# Altium schematic sheet RS485.SchDoc
size A; SheetNumber: 9; SheetTotal: 10
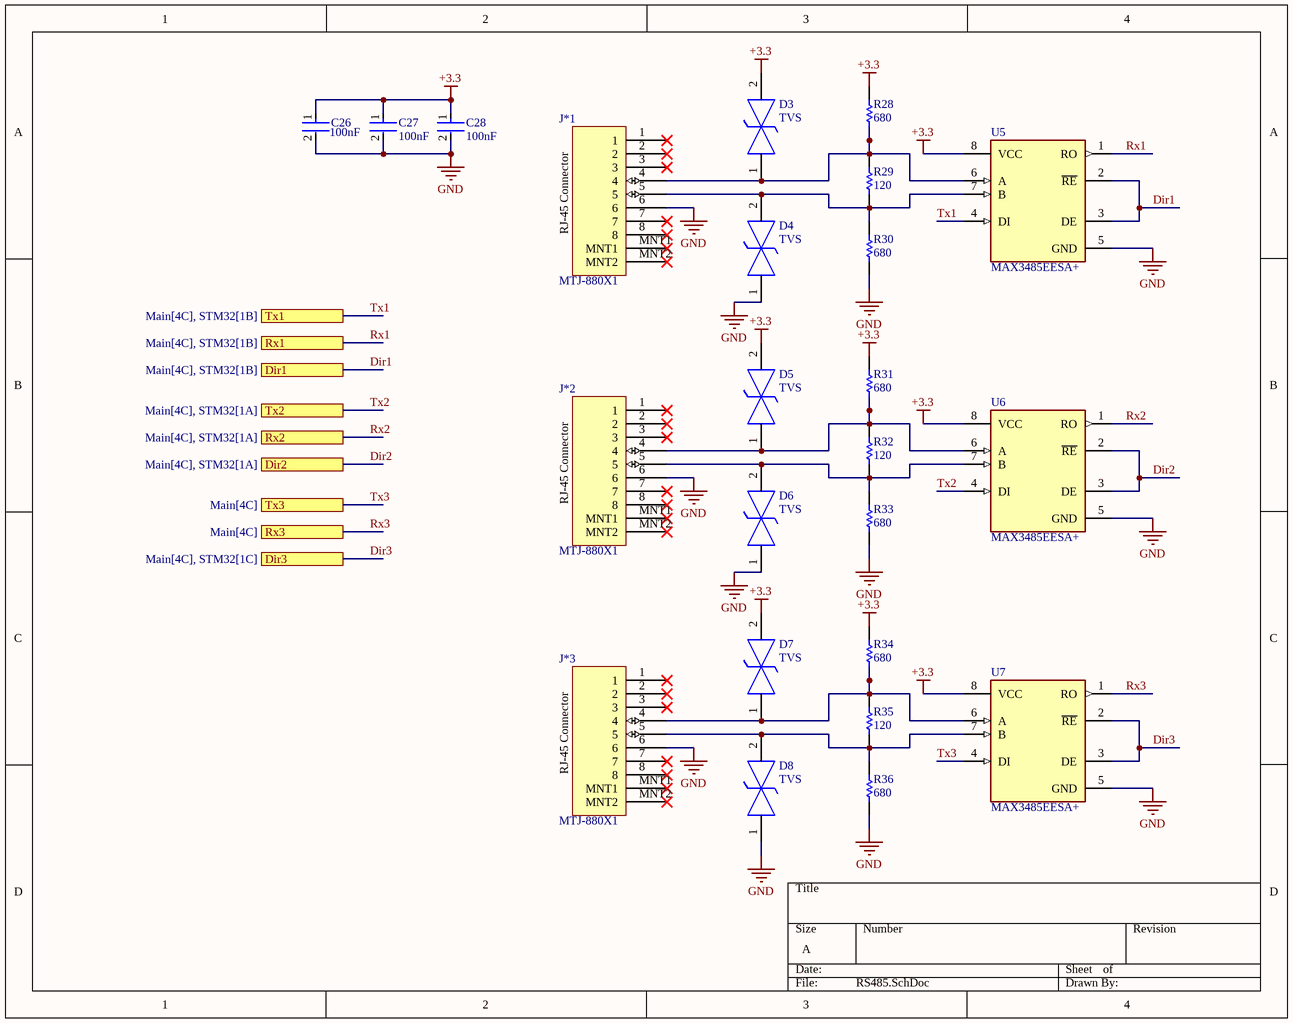
[diagram p0: RS485.SchDoc]

## Parts
C26  100nF  [FP-0805-L_2_01_0_2-W_1_25-IPC_B]
C27  100nF  [FP-0805-L_2_01_0_2-W_1_25-IPC_B]
C28  100nF  [FP-0805-L_2_01_0_2-W_1_25-IPC_B]
D3  TVS  [FP-SMB-MFG]
D4  TVS  [FP-SMB-MFG]
D5  TVS  [FP-SMB-MFG]
D6  TVS  [FP-SMB-MFG]
D7  TVS  [FP-SMB-MFG]
D8  TVS  [FP-SMB-MFG]
J*1  MTJ-880X1  [MTJ-880X1]
J*2  MTJ-880X1  [MTJ-880X1]
J*3  MTJ-880X1  [MTJ-880X1]
R28  680  [RESC2013X50X30LL20T20]
R29  120  [RESC2013X50X30LL20T20]
R30  680  [RESC2013X50X30LL20T20]
R31  680  [RESC2013X50X30LL20T20]
R32  120  [RESC2013X50X30LL20T20]
R33  680  [RESC2013X50X30LL20T20]
R34  680  [RESC2013X50X30LL20T20]
R35  120  [RESC2013X50X30LL20T20]
R36  680  [RESC2013X50X30LL20T20]
U5  MAX3485EESA+  [FP-S8-5-MFG]
U6  MAX3485EESA+  [FP-S8-5-MFG]
U7  MAX3485EESA+  [FP-S8-5-MFG]

## Ports
Dir1 (see Main[4C], STM32[1B]), Dir2 (see Main[4C], STM32[1A]), Dir3 (see Main[4C], STM32[1C]), Rx1 (see Main[4C], STM32[1B]), Rx2 (see Main[4C], STM32[1A]), Rx3 (see Main[4C]), Tx1 (see Main[4C], STM32[1B]), Tx2 (see Main[4C], STM32[1A]), Tx3 (see Main[4C])

## Nets
+3.3: C26.1 C27.1 C28.1 D3.2 D5.2 D7.2 R28.2 R31.2 R34.2 U5.8(VCC) U6.8(VCC) U7.8(VCC)
GND: C26.2 C27.2 C28.2 D4.1 D6.1 D8.1 J*1.6 J*2.6 J*3.6 R30.1 R33.1 R36.1 U5.5(GND) U6.5(GND) U7.5(GND)
Dir1: U5.2(~{RE}) U5.3(DE) ; port Dir1
Dir2: U6.2(~{RE}) U6.3(DE) ; port Dir2
Dir3: U7.2(~{RE}) U7.3(DE) ; port Dir3
Rx1: U5.1(RO) ; port Rx1
Rx2: U6.1(RO) ; port Rx2
Rx3: U7.1(RO) ; port Rx3
Tx1: U5.4(DI) ; port Tx1
Tx2: U6.4(DI) ; port Tx2
Tx3: U7.4(DI) ; port Tx3
NetD3_1: D3.1 J*1.4 R28.1 R29.2 U5.6(A)
NetD4_2: D4.2 J*1.5 R29.1 R30.2 U5.7(B)
NetD5_1: D5.1 J*2.4 R31.1 R32.2 U6.6(A)
NetD6_2: D6.2 J*2.5 R32.1 R33.2 U6.7(B)
NetD7_1: D7.1 J*3.4 R34.1 R35.2 U7.6(A)
NetD8_2: D8.2 J*3.5 R35.1 R36.2 U7.7(B)

Not connected (* = marked no-connect by the designer): J*1 1* 2* 3* 7* 8* MNT1* MNT2*; J*2 1* 2* 3* 7* 8* MNT1* MNT2*; J*3 1* 2* 3* 7* 8* MNT1* MNT2*

## Notes on the sheet
- (in symbol MTJ-880X1) RJ-45 Connector

## Library data of the parts
C26-C28 = CMP-2007-04174-2: General Purpose Ceramic Capacitor, 0805, 100nF, 10%, X7R, 15%, 100V; Packaging: Tape and Reel; Min Operating Temperature: -55°C; Dielectric Material: Ceramic; Height: 1.4mm; Voltage Rating: 100V; Termination: SMD/SMT; Case Code (Imperial): 0805; Case Code (Metric): 2012; Case/Package: 0805; Construction: Flat; Radiation Hardening: No; Series: -; Dielectric: X7R; Package Quantity: 2000; Mount: Surface Mount; Capacitance: 100nF; Contact Plating: Tin; Voltage: 100V; Lead Free: Lead Free; Depth: 1.25mm; RoHS Compliant: Yes; Number of Pins: 2; Max Operating Temperature: 125°C; Length: 2.01mm; Voltage Rating (DC): 100V; Thickness: 0.055inch; REACH SVHC: No SVHC; Width: 0.049inch; Tolerance: 10%
D3-D8 = CMP-12225-000039-1: TVS DIODE 28.2V 59V SMB; Manufacturer Part Number: SM6T33CA; Manufacturer: STMicroelectronics; Max Junction Temp: +150°C; Standoff Height: 0.05mm; Direction: Bidirectional; Number Of Channels: 1; Reverse Standoff Voltage: 33V; Peak Pulse Current: 68A; Breakdown Voltage: 31.4V; Peak Pulse Power: 600W; Mouser Description: TVS Diodes - Transient Voltage Suppressors 600W 33V Bidirect; Device Class L1: Circuit Protection; Device Class L3: unset; Temperature Range Low: -55°C; Octopart: https://octopart.com/sm6t33ca-stmicroelectronics-55399331; Height: 2.65mm; Digikey Description: TVS DIODE 28.2V 59V SMB; Automotive: No; Category: Diode; Device Class L2: TVS Diodes; Temperature: -55°C to +150°C; ComponentLink2URL: https://www.st.com/resource/en/datasheet/sm6t.pdf; Lead Free: Yes; Clamping Voltage: 59V; RoHS: TRUE; Temperature Range High: +150°C; Package: SMB; ComponentLink2Description: Datasheet
R28-R36 = CMP-2001-04896-1: Manufacturer: Vishay Dale; Part Number: CRCW08050000Z0EA
U5-U7 = CMP-05679-000038-1: IC TXRX RS485/422 10MBPS 8SOIC; Manufacturer: Maxim Integrated; Number Of Receivers: 1; Simplex Duplex: Half Duplex; Data Rate: 15Mbits/s; Interface: RS-485,RS-422; Max Supply Voltage: 3.6V; Nominal Supply Current: 0.95-1.1mA; Min Supply Voltage: 3V; Standoff Height: 0.1mm; Mouser Description: RS-422/RS-485 Interface IC 3.3V 12Mbps Transceiver; Lead Free: Yes; Footprint Url: https://pdfserv.maximintegrated.com/land_patterns/90-0096.PDF; Device Class L1: Integrated Circuits (ICs); Device Class L3: RS-232 / RS-422 / RS-485 Interface ICs; RoHS: TRUE; Height: 1.75mm; ComponentLink2URL: https://datasheets.maximintegrated.com/en/ds/MAX3483E-MAX3491E.pdf; Temperature Range High: +85°C; Temperature: -40°C to +85°C; Manufacturer Part Number: MAX3485EESA+; Number Of Transmitters: 1; Device Class L2: Interface ICs; Octopart: https://octopart.com/max3485eesa%2B-maxim+integrated-39731903; ComponentLink2Description: Datasheet; Category: IC; Digikey Description: IC TXRX RS485/422 10MBPS 8SOIC; Automotive: No; Temperature Range Low: -40°C; Package: S8-5